# Altium schematic sheet 3V3_SYS_SUPPLY.SchDoc
size A4; SheetNumber: 4; SheetTotal: 12
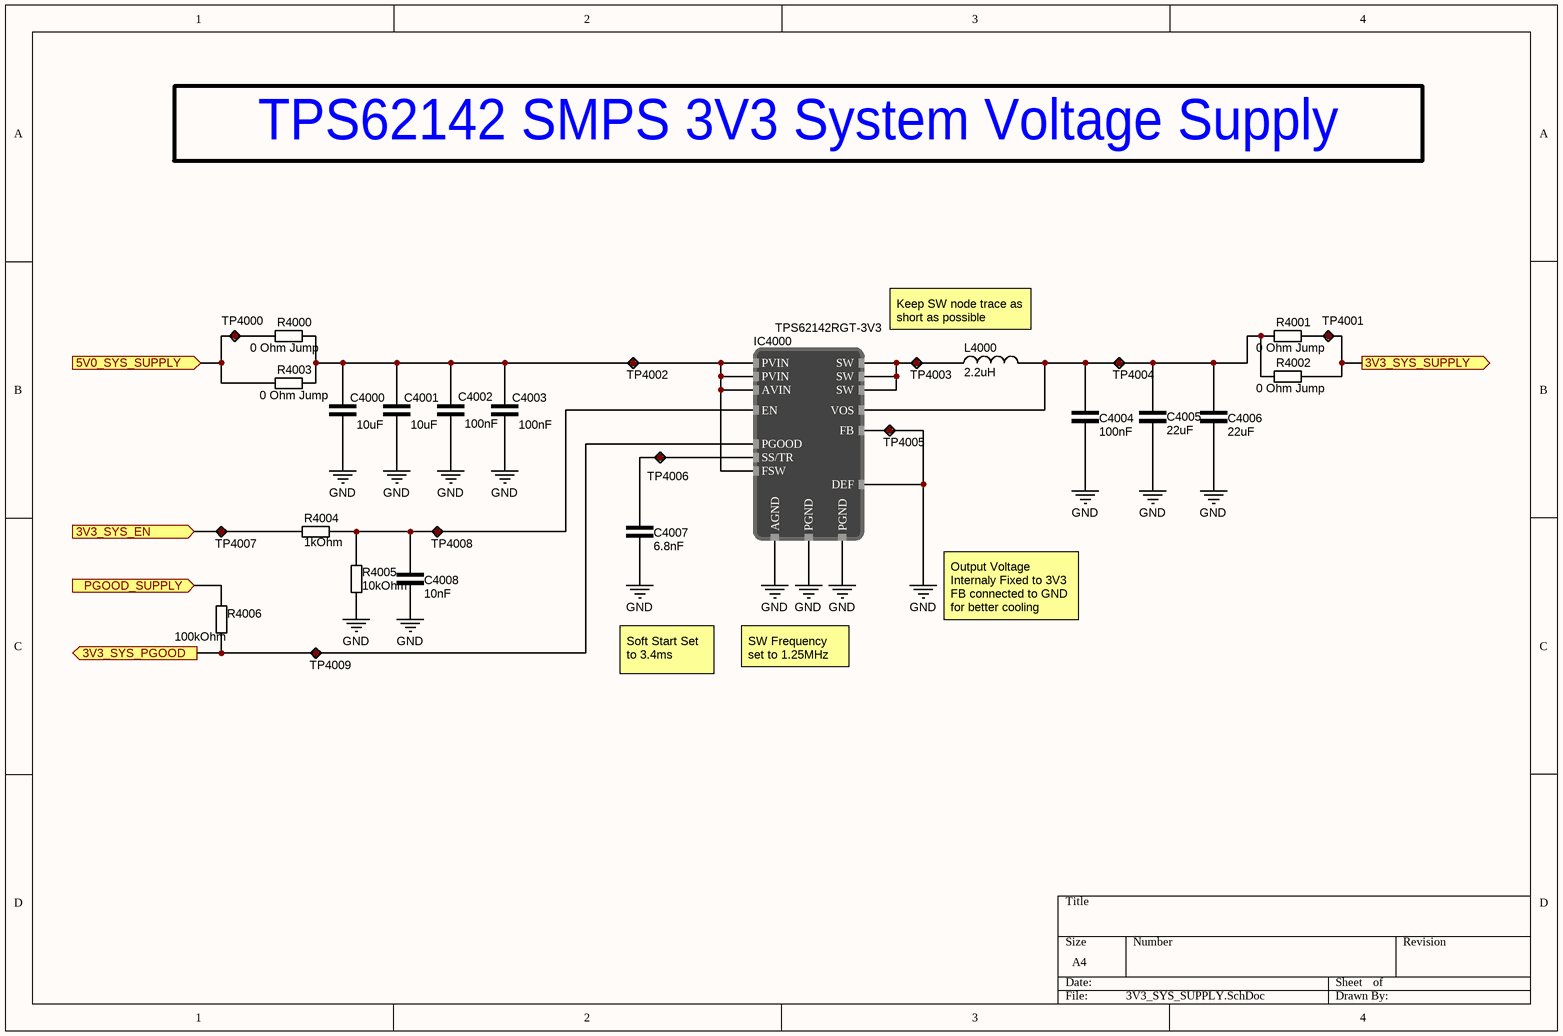
[diagram p0: 3V3_SYS_SUPPLY.SchDoc]

## Parts
C4000  10uF  [CAP_0805]
C4001  10uF  [CAP_0805]
C4002  100nF  [CAP_0603]
C4003  100nF  [CAP_0603]
C4004  100nF  [CAP_0603]
C4005  22uF  [CAP_0805]
C4006  22uF  [CAP_0805]
C4007  6.8nF  [CAP_0603]
C4008  10nF  [CAP_0603]
IC4000  TPS62142RGT-3V3  [QFN50P300X300X100_HS-17N]
L4000  2.2uH  [INDM4441X20N]
R4000  0 Ohm Jump  [RES_0805]
R4001  0 Ohm Jump  [RES_0805]
R4002  0 Ohm Jump  [RES_0805]
R4003  0 Ohm Jump  [RES_0805]
R4004  1kOhm  [RES_0603]
R4005  10kOhm  [RES_0603]
R4006  100kOhm  [RES_0603]
TP4000  Test point  [TestPoint]  (value not drawn)
TP4001  Test point  [TestPoint]  (value not drawn)
TP4002  Test point  [TestPoint]  (value not drawn)
TP4003  Test point  [TestPoint]  (value not drawn)
TP4004  Test point  [TestPoint]  (value not drawn)
TP4005  Test point  [TestPoint]  (value not drawn)
TP4006  Test point  [TestPoint]  (value not drawn)
TP4007  Test point  [TestPoint]  (value not drawn)
TP4008  Test point  [TestPoint]  (value not drawn)
TP4009  Test point  [TestPoint]  (value not drawn)

## Ports
3V3_SYS_EN (in, see 6DOF_CONTROLLER_Top[6A]), 3V3_SYS_PGOOD (out, see 6DOF_CONTROLLER_Top[7A]), 3V3_SYS_SUPPLY (out, see 6DOF_CONTROLLER_Top[7A]), 5V0_SYS_SUPPLY (in, see 6DOF_CONTROLLER_Top[6A], 3V3_MCU_SUPPLY[1B], 5V_SYS_SUPPLY[8A]), PGOOD_SUPPLY (in, see 6DOF_CONTROLLER_Top[6A], 5V0_EXT_SUPPLY[1C], 12V_VMOT_SUPPLY[6C])

## Nets
GND: C4000.1 C4001.1 C4002.2 C4003.1 C4004.1 C4005.1 C4006.2 C4007.1 C4008.1 IC4000.5(FB) IC4000.6(AGND) IC4000.8(DEF) IC4000.15(PGND) IC4000.16(PGND) R4005.1 TP4005.1
3V3_SYS_EN: R4004.1 TP4007.1 ; port 3V3_SYS_EN
3V3_SYS_PGOOD: IC4000.4(PGOOD) R4006.1 TP4009.1 ; port 3V3_SYS_PGOOD
3V3_SYS_SUPPLY: R4001.2 R4002.2 TP4001.1 ; port 3V3_SYS_SUPPLY
5V0_SYS_SUPPLY: R4000.1 R4003.1 TP4000.1 ; port 5V0_SYS_SUPPLY
PGOOD_SUPPLY: R4006.2 ; port PGOOD_SUPPLY
NetC4000_2: C4000.2 C4001.2 C4002.1 C4003.2 IC4000.7(FSW) IC4000.10(AVIN) IC4000.11(PVIN) IC4000.12(PVIN) R4000.2 R4003.2 TP4002.1
NetC4004_2: C4004.2 C4005.2 C4006.1 IC4000.14(VOS) L4000.2 R4001.1 R4002.1 TP4004.1
NetC4007_2: C4007.2 IC4000.9(SS/TR) TP4006.1
NetC4008_2: C4008.2 IC4000.13(EN) R4004.2 R4005.2 TP4008.1
NetIC4000_1: IC4000.1(SW) IC4000.2(SW) IC4000.3(SW) L4000.1 TP4003.1

## Notes on the sheet
- TPS62142 SMPS 3V3 System Voltage Supply
- Keep SW node trace as short as possible
- Output Voltage Internaly Fixed to 3V3
  FB connected to GND for better cooling
- Soft Start Set to 3.4ms
- SW Frequency set to 1.25MHz

## Library data of the parts
C4000 C4001 = C000002: 10 µF ±10% 25V Ceramic Capacitor X5R 0805 (2012 Metric); ComponentLink1Description: DigiKey; ComponentLink1URL: https://www.digikey.com/en/products/detail/tdk-corporation/C2012X5R1E106K125AB/2443462; DigiKey Part Number: 445-5984-1-ND; capacitance: 10uF
C4002-C4004 = C000007: 0.1 µF ±10% 25V Ceramic Capacitor X7R 0603 (1608 Metric); ComponentLink1Description: DigiKey; ComponentLink1URL: https://www.digikey.com/en/products/detail/kyocera-avx/06033C104K4T2A/8019250; DigiKey Part Number: 478-KAM15AR71E104KTCT-ND; capacitance: 100nF
C4005 C4006 = C000001: 22 µF ±20% 25V Ceramic Capacitor X5R 0805 (2012 Metric); ComponentLink1Description: DigiKey; ComponentLink1URL: https://www.digikey.com/en/products/detail/tdk-corporation/C2012X5R1E226M125AC/3661564; DigiKey Part Number: 445-9112-1-ND; capacitance: 22uF
C4007 = C000023: 6800 pF ±10% 25V Ceramic Capacitor X7R 0603 (1608 Metric); ComponentLink1Description: DigiKey; ComponentLink1URL: https://www.digikey.com/en/products/detail/yageo/CC0603KRX7R8BB682/5883791; DigiKey Part Number: 311-4090-1-ND; capacitance: 6.8nF
C4008 = C000005: 10000 pF ±20% 25V Ceramic Capacitor X7R 0603 (1608 Metric); ComponentLink1Description: DigiKey; ComponentLink1URL: https://www.digikey.com/en/products/detail/kyocera-avx/06033C103MAT2A/1599370; DigiKey Part Number: 478-KGM15AR71E103MTCT-ND; capacitance: 10nF
IC4000 = TPS62142RGT: Buck Switching Regulator IC Positive Fixed 3.3V 1 Output 2A 16-VFQFN Exposed Pad; DigiKey Part Number: 296-29940-1-ND; Mouser Part Number: 595-TPS62142RGTT; ComponentLink1Description: DigiKey; ComponentLink1URL: https://www.digikey.com/en/products/detail/texas-instruments/TPS62142RGTT/2786730; ComponentLink2Description: Mouser; ComponentLink2URL: https://eu.mouser.com/ProductDetail/Texas-Instruments/TPS62142RGTT?qs=gXEV9p%2FxLgdBrEoz0pTJSA%3D%3D
L4000 = L000008: FIXED IND 2.2UH 4A 61 MOHM SMD; inductance: 2.2uH; DigiKey Part Number: SRP4020TA-2R2MCT-ND; ComponentLink1Description: DigiKey; ComponentLink1URL: https://www.digikey.com/en/products/detail/bourns-inc/SRP4020TA-2R2M/4901004?s=N4IgTCBcDaIMoCUAKAWADGNAVAggWjATAFkQBdAXyA
R4000-R4003 = R000011: 0 Ohms Jumper Chip Resistor 0805 (2012 Metric) Automotive AEC-Q200 Thick Film; ComponentLink1Description: DigiKey; ComponentLink1URL: https://www.digikey.com/en/products/detail/panasonic-electronic-components/ERJ-6GEY0R00V/78163; resistance: 0 Ohm Jump; DigiKey Part Number: P0.0ACT-ND
R4004 = R000004: 1 kOhms ±1% 0.125W, 1/8W Chip Resistor 0603 (1608 Metric) Anti-Sulfur Thin Film; resistance: 1kOhm; ComponentLink1Description: DigiKey; ComponentLink1URL: https://www.digikey.com/en/products/detail/vishay-beyschlag-draloric-bc-components/MCT06030C1001FP500/2607821; DigiKey Part Number: MCT0603-1.00K-CFCT-ND
R4005 = R000001: 10 kOhms ±1% 0.125W, 1/8W Chip Resistor 0603 (1608 Metric) Anti-Sulfur Thin Film; resistance: 10kOhm; ComponentLink1Description: DigiKey; ComponentLink1URL: https://www.digikey.com/en/products/detail/vishay-beyschlag-draloric-bc-components/MCT06030C1002FP500/1850440; DigiKey Part Number: MCT0603-10.0K-CFCT-ND
R4006 = R000006: 100 kOhms ±1% 0.1W, 1/10W Chip Resistor 0603 (1608 Metric) Automotive AEC-Q200 Thick Film; resistance: 100kOhm; ComponentLink1Description: DigiKey; ComponentLink1URL: https://www.digikey.com/en/products/detail/stackpole-electronics-inc/RMCF0603FG100K/1713543; DigiKey Part Number: RMCF0603FG100KCT-ND
TP4000-TP4009 = TP002: Test point 1mm